# Altium project bldc_motor_driver.PrjPcb
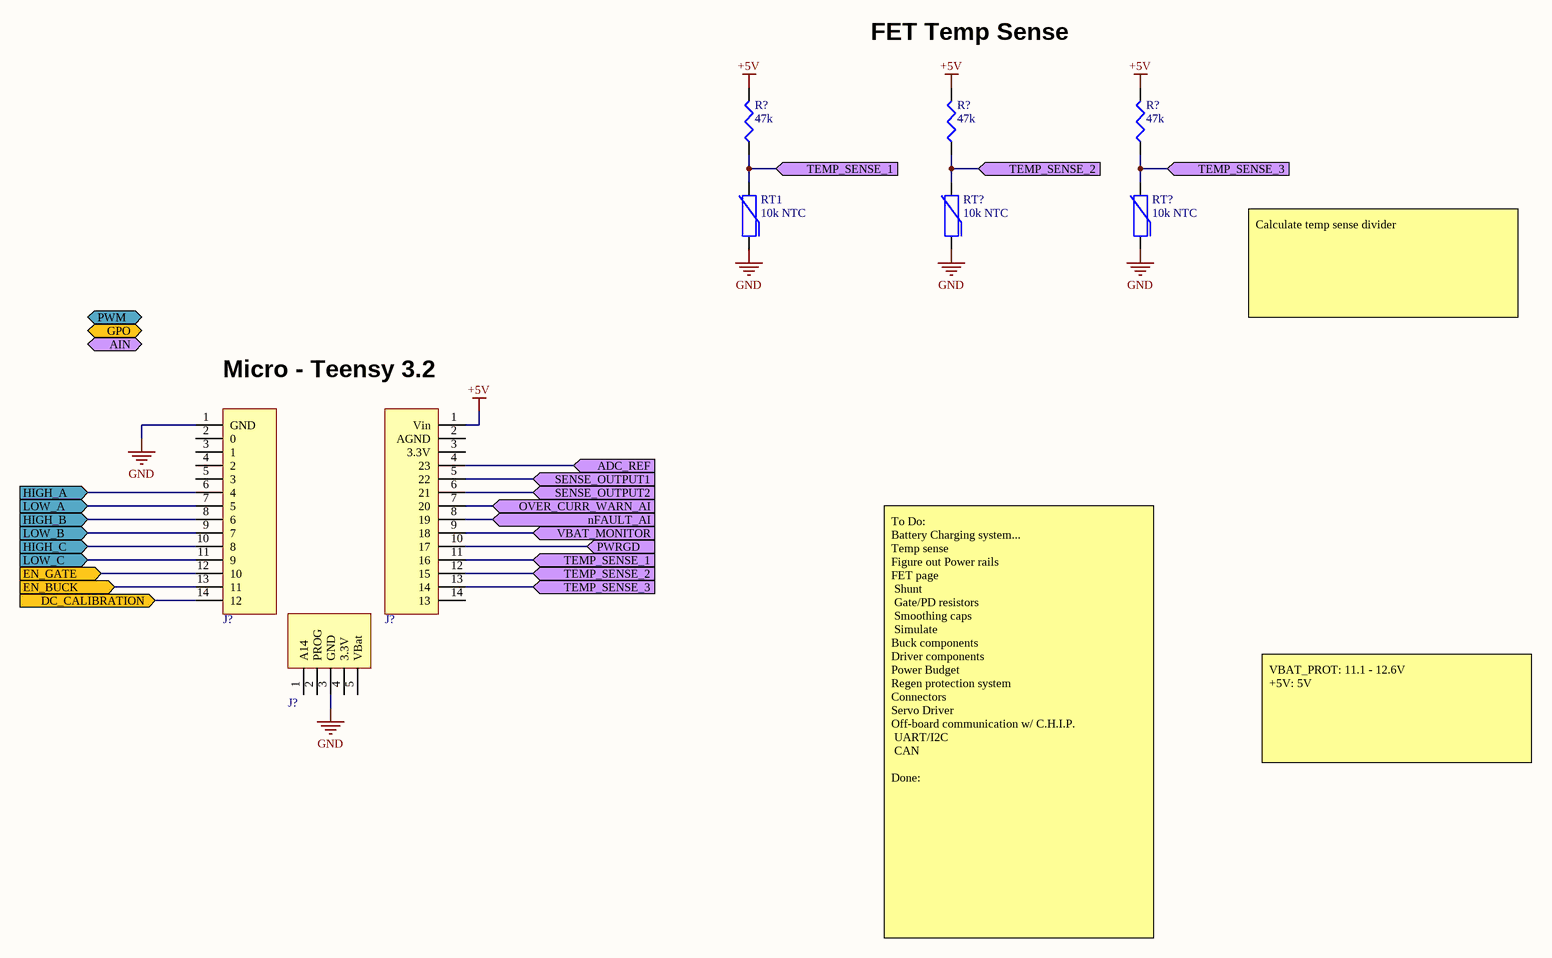
[diagram p0: [01] Micro.SchDoc]
4 sheets, 82 parts. Net scope: flat (ports and power ports of the same name join across sheets).
Sheets:
  [01] Micro.SchDoc
  [02] Power.SchDoc
  [03] Motor Driver.SchDoc
  [04] Half-Bridges.SchDoc

## Sheet [01] Micro.SchDoc
size B; Organization: Altium Limited; Address1: L3, 12a Rodborough Rd; Address2: Frenchs Forest; Address3: NSW; Address4: Australia 2086

### Parts
(Parts that share a designator on the sheet are numbered #1, #2 ... from top to bottom, then left to right.)
J?#1  HEADER TEENSY A  [14 POS HEADER]  (value not drawn)
J?#2  HEADER TEENSY C  [14 POS HEADER]  (value not drawn)
J?#3  HEADER TEENSY B  [5 POS HEADER]  (value not drawn)
R?#1  47k  [0603_CAP]
R?#2  47k  [0603_CAP]
R?#3  47k  [0603_CAP]
RT1  10k NTC  [0603_CAP]
RT?#1  10k NTC  [0603_CAP]
RT?#2  10k NTC  [0603_CAP]

### Ports
ADC_REF (in), AIN (bidir), DC_CALIBRATION (in), EN_BUCK (in), EN_GATE (in), GPO (bidir), HIGH_A (in), HIGH_B (in), HIGH_C (in), LOW_A (in), LOW_B (in), LOW_C (in), nFAULT_AI (in), OVER_CURR_WARN_AI (in), PWM (bidir), PWRGD (in), SENSE_OUTPUT1 (in), SENSE_OUTPUT2 (in), TEMP_SENSE_1 (in), TEMP_SENSE_2 (in), TEMP_SENSE_3 (in), VBAT_MONITOR (in)

### Nets
+5V: J?#2.1(Vin) R?#1.2 R?#2.2 R?#3.2
GND: J?#1.1(GND) J?#3.3(GND) RT1.1 RT?#1.1 RT?#2.1  [project net MOTOR_SHUNT_LS_A]
NetC?#8_2: J?#2.9(18) ; port VBAT_MONITOR
NetC?#13_2: J?#2.7(20) ; port OVER_CURR_WARN_AI
NetC?#18_2: J?#2.8(19) ; port nFAULT_AI
NetJ?#1_6: J?#1.6(4) ; port HIGH_A
NetJ?#1_7: J?#1.7(5) ; port LOW_A
NetJ?#1_8: J?#1.8(6) ; port HIGH_B
NetJ?#1_9: J?#1.9(7) ; port LOW_B
NetJ?#1_10: J?#1.10(8) ; port HIGH_C
NetJ?#1_11: J?#1.11(9) ; port LOW_C
NetJ?#1_12: J?#1.12(10) ; port EN_GATE
NetJ?#1_13: J?#1.13(11) ; port EN_BUCK
NetJ?#1_14: J?#1.14(12) ; port DC_CALIBRATION
NetJ?#2_4: J?#2.4(23) ; port ADC_REF
NetJ?#2_5: J?#2.5(22) ; port SENSE_OUTPUT1
NetJ?#2_6: J?#2.6(21) ; port SENSE_OUTPUT2
NetJ?#2_10: J?#2.10(17) ; port PWRGD
NetJ?#2_11: J?#2.11(16) R?#1.1 RT1.2 ; port TEMP_SENSE_1
NetJ?#2_12: J?#2.12(15) R?#2.1 RT?#1.2 ; port TEMP_SENSE_2
NetJ?#2_13: J?#2.13(14) R?#3.1 RT?#2.2 ; port TEMP_SENSE_3

Not connected (* = marked no-connect by the designer): J?#1 2(0) 3(1) 4(2) 5(3); J?#2 2(AGND) 3(3.3V) 14(13); J?#3 1(A14) 2(PROG) 4(3.3V) 5(VBat)

### Notes on the sheet
- FET Temp Sense
- Calculate temp sense divider
- (near J?#1) Micro - Teensy 3.2
- VBAT_PROT: 11.1 - 12.6V
  +5V: 5V
- To Do:
  Battery Charging system...
  Temp sense
  Figure out Power rails
  FET page
  Shunt
  Gate/PD resistors
  Smoothing caps
  Simulate
  Buck components
  Driver components
  Power Budget
  Regen protection system
  Connectors
  Servo Driver
  Off-board communication w/ C.H.I.P.
  UART/I2C
  CAN
  Done:
- Title
- Size:
- Date:
- B
- Number:
- Time:
- Revision:
- Sheet
- of
- File:

### Library data of the parts
J?#1 = HEADER TEENSY A: SOCKET 7 MM SOLDER TAIL SINGLE; Manufacturer 1: Preci-Dip; Manufacturer Part Number 1: 801-87-014-10-001101; Category 1: Connectors, Interconnects; Number of Positions: 14; Number of Positions Loaded: All; Pitch: 0.100" (2.54mm); Supplier 1: Digi-Key; RoHS: RoHS Compliant; Description 1: SOCKET 7 MM SOLDER TAIL SINGLE; Stock 1: 1111; Pricing 1: 1=1.21, 10=1.065, 100=0.9185, 500=0.75148, 1000=0.66798, 5000=0.58449, 10000=0.55526 (USD); Packaging: Bulk; Part Status: Active; Connector Type: Socket; Contact Type: Female Socket; Number of Rows: 1; Row Spacing: -; Mounting Type: Through Hole; Termination: Solder; Fastening Type: -; Features: -; Contact Finish: Gold; Contact Finish Thickness: Flash; Color: Black; ComponentLink1URL: http://www.precidip.com/AppHost/9696,1/Scripts/Modules/Catalog/Default.aspx?c=7&i=310&p=107&pdf=1&dsku=801-PP-NNN-10-001101; ComponentLink1Description: http://www.precidip.com/AppHost/9696,1/Scripts/Modules/Catalog/Default.aspx?c=7&i=310&p=107&pdf=1&dsku=801-PP-NNN-10-001101; Supplier Part Number 1: 1212-1201-ND
J?#2 = HEADER TEENSY C: SOCKET 7 MM SOLDER TAIL SINGLE; Manufacturer 1: Preci-Dip; Manufacturer Part Number 1: 801-87-014-10-001101; Category 1: Connectors, Interconnects; Number of Positions: 14; Number of Positions Loaded: All; Pitch: 0.100" (2.54mm); Supplier 1: Digi-Key; RoHS: RoHS Compliant; Description 1: SOCKET 7 MM SOLDER TAIL SINGLE; Stock 1: 1111; Pricing 1: 1=1.21, 10=1.065, 100=0.9185, 500=0.75148, 1000=0.66798, 5000=0.58449, 10000=0.55526 (USD); Packaging: Bulk; Part Status: Active; Connector Type: Socket; Contact Type: Female Socket; Number of Rows: 1; Row Spacing: -; Mounting Type: Through Hole; Termination: Solder; Fastening Type: -; Features: -; Contact Finish: Gold; Contact Finish Thickness: Flash; Color: Black; ComponentLink1URL: http://www.precidip.com/AppHost/9696,1/Scripts/Modules/Catalog/Default.aspx?c=7&i=310&p=107&pdf=1&dsku=801-PP-NNN-10-001101; ComponentLink1Description: http://www.precidip.com/AppHost/9696,1/Scripts/Modules/Catalog/Default.aspx?c=7&i=310&p=107&pdf=1&dsku=801-PP-NNN-10-001101; Supplier Part Number 1: 1212-1201-ND
J?#3 = HEADER TEENSY B: SOCKET 7 MM SOLDER TAIL SINGLE; Manufacturer 1: Preci-Dip; Manufacturer Part Number 1: 801-87-005-10-001101; Category 1: Connectors, Interconnects; Number of Positions: 5; Number of Positions Loaded: All; Pitch: 0.100" (2.54mm); Supplier 1: Digi-Key; RoHS: RoHS Compliant; Description 1: SOCKET 7 MM SOLDER TAIL SINGLE; Stock 1: 1229; Pricing 1: 1=0.49, 10=0.459, 100=0.3521, 500=0.3062, 1000=0.25262, 5000=0.222, 10000=0.20669 (USD); Packaging: Bulk; Part Status: Active; Connector Type: Socket; Contact Type: Female Socket; Number of Rows: 1; Row Spacing: -; Mounting Type: Through Hole; Termination: Solder; Fastening Type: -; Features: -; Contact Finish: Gold; Contact Finish Thickness: Flash; Color: Black; ComponentLink1URL: http://www.precidip.com/AppHost/9696,1/Scripts/Modules/Catalog/Default.aspx?c=7&i=310&p=107&pdf=1&dsku=801-PP-NNN-10-001101; ComponentLink1Description: http://www.precidip.com/AppHost/9696,1/Scripts/Modules/Catalog/Default.aspx?c=7&i=310&p=107&pdf=1&dsku=801-PP-NNN-10-001101; Supplier Part Number 1: 1212-1183-ND
R?#1-R?#3 = RC0603FR-073K3L: RES SMD 3.3K OHM 1% 1/10W 0603; Manufacturer 1: Yageo; Category 1: Resistors; Power (Watts): 0.1W, 1/10W; Temperature Coefficient: ±100ppm/°C; Supplier 1: Digi-Key; Manufacturer Part Number 1: RC0603FR-073K3L; RoHS: RoHS Compliant; Description 1: RES SMD 3.3K OHM 1% 1/10W 0603; Stock 1: 668905; Pricing 1: 1=0.1, 10=0.014, 25=0.01, 100=0.0057, 250=0.00436, 500=0.00348, 1000=0.00257, 2500=0.00223 (USD); Packaging: Cut Tape (CT); Resistance (Ohms): 3.3k; Tolerance: ±1%; Composition: Thick Film; Features: Moisture Resistant; Operating Temperature: -55°C ~ 155°C; Package / Case: 0603 (1608 Metric); Supplier Device Package: 0603; Size / Dimension: 0.063" L x 0.031" W (1.60mm x 0.80mm); Height: 0.022" (0.55mm); Number of Terminations: 2; ComponentLink1URL: http://www.yageo.com/documents/recent/PYu-RC_Group_51_RoHS_L_04.pdf; ComponentLink1Description: http://www.yageo.com/documents/recent/PYu-RC_Group_51_RoHS_L_04.pdf; Supplier Part Number 1: 311-3.30KHRCT-ND
RT1 RT?#1 RT?#2 = NCP18XH103J03RB: THERMISTOR 10K OHM NTC 0603 SMD; Manufacturer 1: Murata Electronics North America; Category 1: Sensors, Transducers; Resistance Tolerance: ±5%; B Value Tolerance: ±1%; B25/50: 3380K; B25/85: 3434K; B25/100: 3455K; Power - Max: 100mW; Supplier 1: Digi-Key; Manufacturer Part Number 1: NCP18XH103J03RB; RoHS: RoHS Compliant; Description 1: THERMISTOR 10K OHM NTC 0603 SMD; Stock 1: 94115; Pricing 1: 1=0.2, 10=0.169, 25=0.1556, 50=0.1244, 100=0.1067, 250=0.09776, 500=0.09332, 1000=0.07999 (USD); Packaging: Cut Tape (CT); Resistance in Ohms @ 25°C: 10k; B0/50: -; B25/75: -; Operating Temperature: -40°C ~ 125°C; Length - Lead Wire: -; Mounting Type: Surface Mount; Package / Case: 0603 (1608 Metric); ComponentLink1URL: http://www.murata.com/~/media/webrenewal/support/library/catalog/products/thermistor/ntc/r44e.ashx; ComponentLink1Description: http://www.murata.com/~/media/webrenewal/support/library/catalog/products/thermistor/ntc/r44e.ashx; Supplier Part Number 1: 490-2436-1-ND

## Sheet [02] Power.SchDoc
size B; Organization: Altium Limited; Address1: L3, 12a Rodborough Rd; Address2: Frenchs Forest; Address3: NSW; Address4: Australia 2086
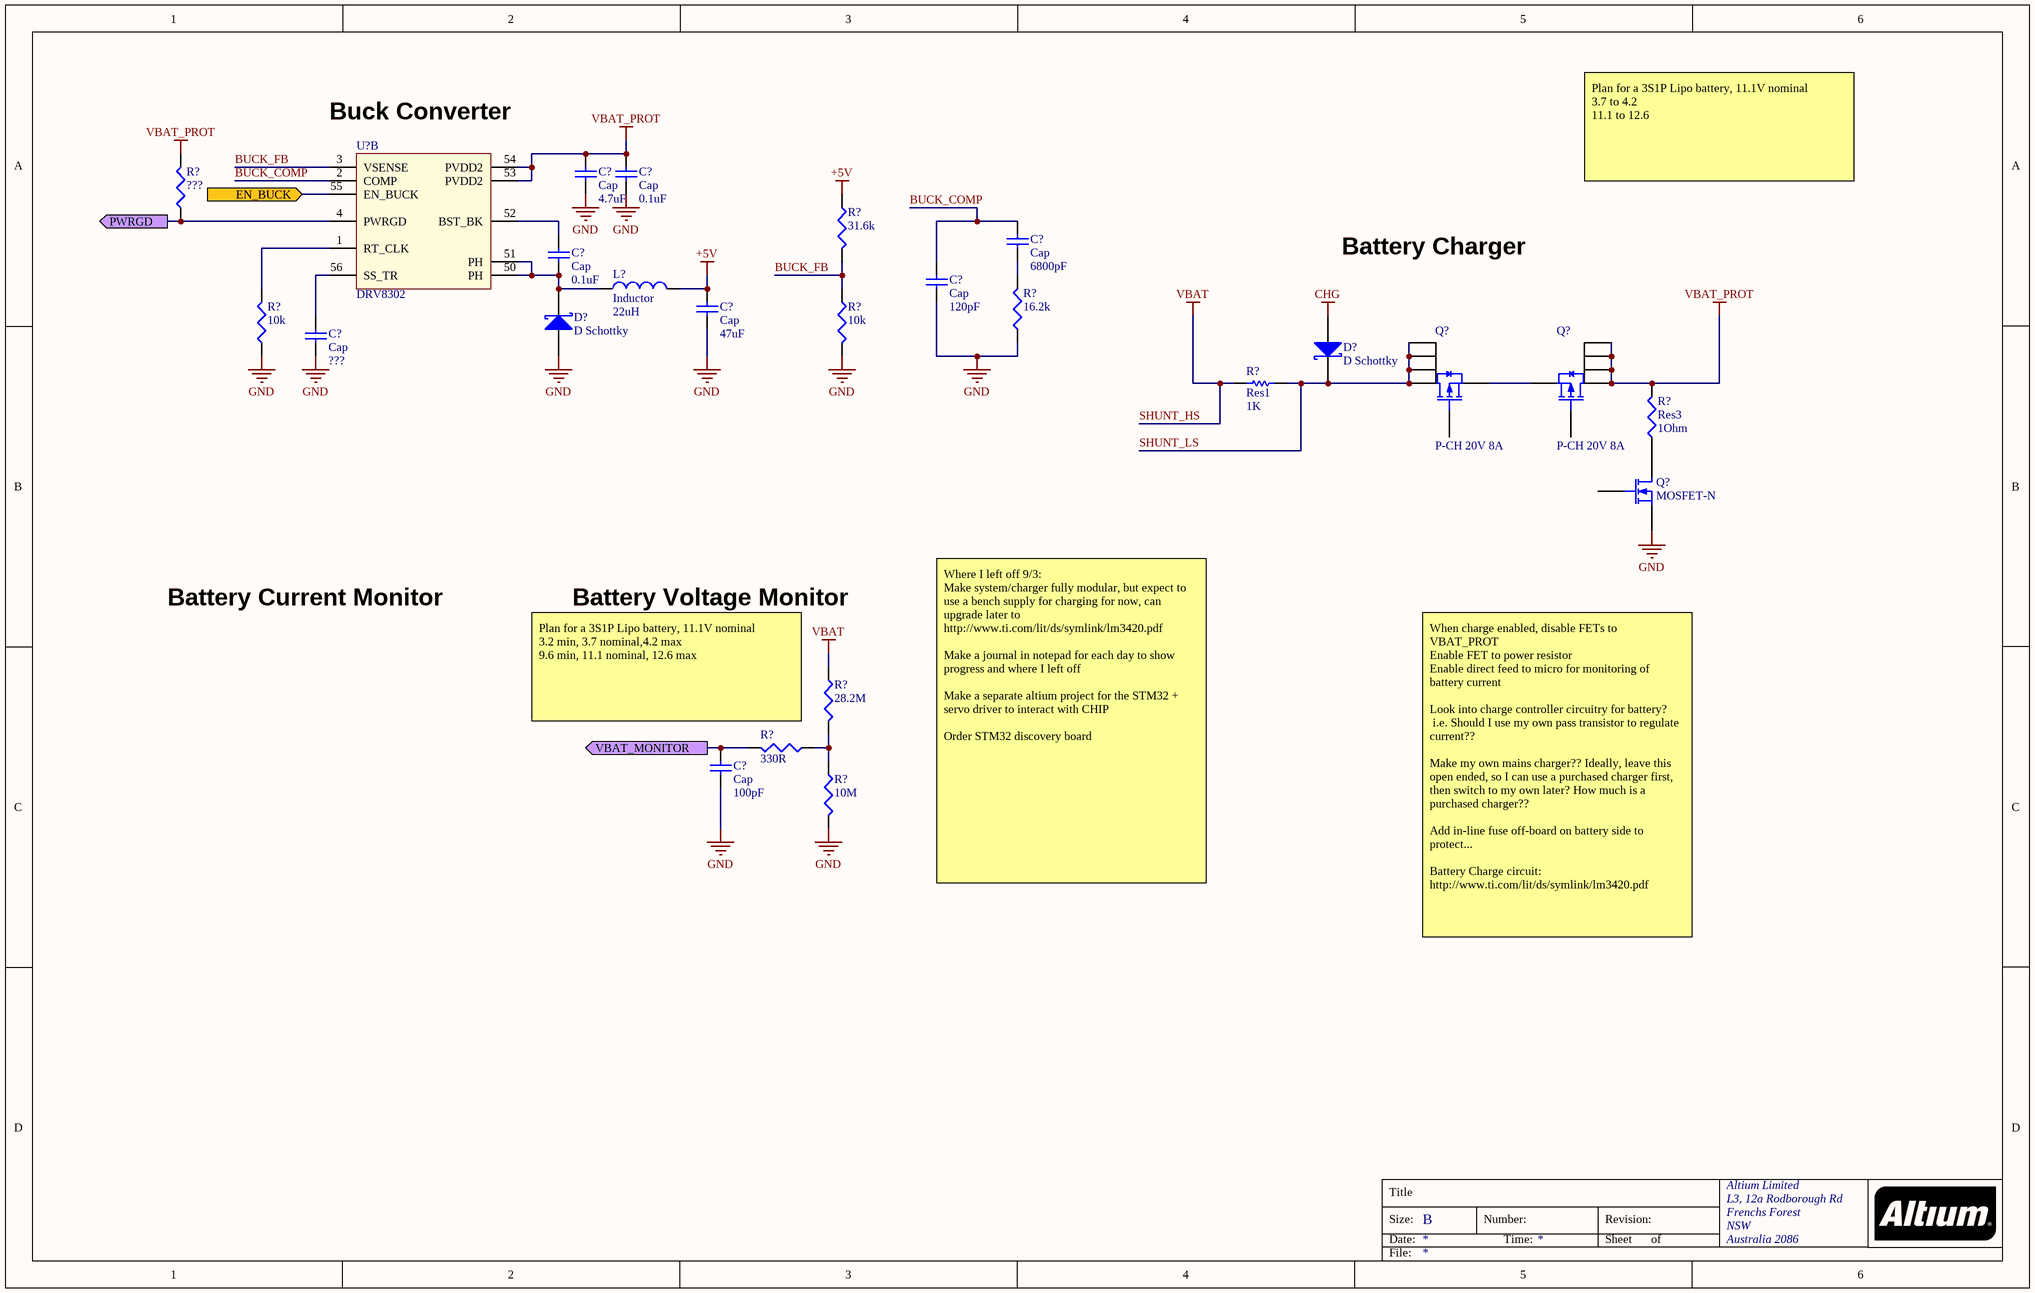
[diagram p1: [02] Power.SchDoc]

### Parts
(Parts that share a designator on the sheet are numbered #1, #2 ... from top to bottom, then left to right.)
C?#1  Cap  value 4.7uF  [RAD-0.3]
C?#2  Cap  value 0.1uF  [RAD-0.3]
C?#3  Cap  value 6800pF  [RAD-0.3]
C?#4  Cap  value 0.1uF  [RAD-0.3]
C?#5  Cap  value 120pF  [RAD-0.3]
C?#6  Cap  value 47uF  [RAD-0.3]
C?#7  Cap  value ???  [RAD-0.3]
C?#8  Cap  value 100pF  [RAD-0.3]
D?#1  D Schottky  [SMB]
D?#2  D Schottky  [SMB]
L?  Inductor  value 22uH  [AXIAL-0.8]
Q?#1  P-CH 20V 8A  [TSOP-6]
Q?#2  P-CH 20V 8A  [TSOP-6]
Q?#3  MOSFET-N  [E3]
R?#4  ???  [0603_CAP]
R?#5  31.6k  [0603_CAP]
R?#6  16.2k  [0603_CAP]
R?#7  10k  [0603_CAP]
R?#8  10k  [0603_CAP]
R?#9  Res1  value 1K  [AXIAL-0.3]
R?#10  Res3  value 1Ohm  [J1-0603]
R?#11  28.2M  [0603_CAP]
R?#12  330R  [0603_CAP]
R?#13  10M  [0603_CAP]
U?#1  DRV8302  (part B of 2)

### Ports
EN_BUCK (in), PWRGD (out), VBAT_MONITOR (out)

### Nets
+5V: C?#6.2 L?.2 R?#5.2
CHG: D?#2.1(A)
GND: C?#1.1 C?#2.1 C?#5.1 C?#6.1 C?#7.1 C?#8.1 D?#1.1(A) Q?#3.3(S) R?#6.1 R?#7.1 R?#8.1 R?#13.1  [project net MOTOR_SHUNT_LS_A]
SHUNT_HS: R?#9.1 R?#11.2  [also labelled VBAT]
VBAT_PROT: C?#1.2 C?#2.2 Q?#2.1(D) Q?#2.2(D) Q?#2.5(D) Q?#2.6(D) R?#4.2 R?#10.2 U?#1.53(PVDD2) U?#1.54(PVDD2)
BUCK_COMP: C?#3.2 C?#5.2 U?#1.2(COMP)
BUCK_FB: R?#5.1 R?#8.2 U?#1.3(VSENSE)
SHUNT_LS: D?#2.2(K) Q?#1.1(D) Q?#1.2(D) Q?#1.5(D) Q?#1.6(D) R?#9.2
NetC?#3_1: C?#3.1 R?#6.2
NetC?#4_1: C?#4.1 D?#1.2(K) L?.1 U?#1.50(PH) U?#1.51(PH)
NetC?#4_2: C?#4.2 U?#1.52(BST_BK)
NetC?#7_2: C?#7.2 U?#1.56(SS_TR)
NetC?#8_2: C?#8.2 R?#12.1 ; port VBAT_MONITOR
NetJ?#1_13: U?#1.55(EN_BUCK) ; port EN_BUCK
NetJ?#2_10: R?#4.1 U?#1.4(PWRGD) ; port PWRGD
NetQ?#1_4: Q?#1.4(S) Q?#2.4(S)
NetQ?#3_1: Q?#3.1(D) R?#10.1
NetR?#7_2: R?#7.2 U?#1.1(RT_CLK)
NetR?#11_1: R?#11.1 R?#12.2 R?#13.2

Not connected (* = marked no-connect by the designer): Q?#1 3(G); Q?#2 3(G); Q?#3 2(G)

### Notes on the sheet
- (near U?#1) Buck Converter
- Plan for a 3S1P Lipo battery, 11.1V nominal
  3.7 to 4.2
  11.1 to 12.6
- Battery Charger
- Battery Current Monitor
- Battery Voltage Monitor
- (near R?#11) Plan for a 3S1P Lipo battery, 11.1V nominal
  3.2 min, 3.7 nominal,4.2 max
  9.6 min, 11.1 nominal, 12.6 max
- Where I left off 9/3:
  Make system/charger fully modular, but expect to use a bench supply for charging for now, can upgrade later to
  http://www.ti.com/lit/ds/symlink/lm3420.pdf
  Make a journal in notepad for each day to show progress and where I left off
  Make a separate altium project for the STM32 + servo driver to interact with CHIP
  Order STM32 discovery board
- When charge enabled, disable FETs to VBAT_PROT
  Enable FET to power resistor
  Enable direct feed to micro for monitoring of battery current
  Look into charge controller circuitry for battery?
  i.e. Should I use my own pass transistor to regulate current??
  Make my own mains charger?? Ideally, leave this open ended, so I can use a purchased charger first, then switch to my own later? How much is a purchased charger??
  Add in-line fuse off-board on battery side to protect...
  Battery Charge circuit:
  http://www.ti.com/lit/ds/symlink/lm3420.pdf
- Title
- Size:
- Date:
- B
- Number:
- Time:
- Revision:
- Sheet
- of
- File:

### Library data of the parts
C?#1-C?#8 = Cap: Capacitor; Published: 8-Jun-2000; LatestRevisionDate: 17-Jul-2002; LatestRevisionNote: Re-released for DXP Platform.; PackageReference: RAD-0.3; Publisher: Altium Limited; PackageDescription: Radial Cap, Thru-Hole; 2 Leads; 0.3 in Pin Spacing
D?#1 D?#2 = D Schottky: Schottky Diode; Published: 8-Jun-2000; LatestRevisionDate: 17-Jul-2002; LatestRevisionNote: Re-released for DXP Platform.; PackageReference: SMB; Publisher: Altium Limited; PackageDescription: DO-214-AA/SMB; 2 C-Bend Leads; Body 5.3 x 3.6 mm, inc. leads (LxW); Code_JEDEC: DO-214-AA
L? = Inductor: Code_IEC: 1005; Published: 8-Jun-2000; LatestRevisionDate: 29-May-2009; LatestRevisionNote: IPC-7351 Footprint Added.; PackageReference: 0402-A; Publisher: Altium Limited; PackageDescription: Chip Inductor; Code_JEITA: 0402
Q?#1 Q?#2 = SI3407DV-T1-GE3: MOSFET P-CH 20V 8A 6-TSOP; Manufacturer 1: Vishay Siliconix; Category 1: Discrete Semiconductor Products; FET Type: MOSFET P-Channel, Metal Oxide; FET Feature: Standard; Current - Continuous Drain (Id) @ 25°C: 8A (Tc); Rds On (Max) @ Id, Vgs: 24 mOhm @ 7.5A, 4.5V; Vgs(th) (Max) @ Id: 1.5V @ 250µA; Gate Charge (Qg) @ Vgs: 63nC @ 10V; Input Capacitance (Ciss) @ Vds: 1670pF @ 10V; Power - Max: 4.2W; Supplier 1: Digi-Key; Manufacturer Part Number 1: SI3407DV-T1-GE3; RoHS: RoHS Compliant; Description 1: MOSFET P-CH 20V 8A 6-TSOP; Stock 1: 6059; Pricing 1: 1=0.5, 10=0.425, 25=0.3964, 100=0.3172, 250=0.2946, 500=0.24926, 1000=0.19261 (USD); Packaging: Cut Tape (CT); Part Status: Active; Drain to Source Voltage (Vdss): 20V; Operating Temperature: -55°C ~ 150°C (TJ); Mounting Type: Surface Mount; Package / Case: SOT-23-6 Thin, TSOT-23-6; Supplier Device Package: 6-TSOP; ComponentLink1URL: http://www.vishay.com/docs/69987/si3407dv.pdf; ComponentLink1Description: http://www.vishay.com/docs/69987/si3407dv.pdf; Supplier Part Number 1: SI3407DV-T1-GE3CT-ND
Q?#3 = MOSFET-N: N-Channel MOSFET; Published: 8-Jun-2000; LatestRevisionDate: 17-Jul-2002; LatestRevisionNote: Re-released for DXP Platform.; PackageVersion: 1995/1996; PackageReference: E3; Publisher: Altium Limited; PackageDescription: TO, Flat Index; 3 In-Line, Axial Leads; Body Dia. 4.6mm; Lead Dia. 0.5 mm (max)
R?#4-R?#8 R?#11-R?#13 = RC0603FR-073K3L: as R?#1 on sheet [01] Micro; Supplier 1: Digi-Key; Manufacturer Part Number 1: RC0603FR-073K3L; RoHS: RoHS Compliant; Description 1: RES SMD 3.3K OHM 1% 1/10W 0603; Stock 1: 668905; Pricing 1: 1=0.1, 10=0.014, 25=0.01, 100=0.0057, 250=0.00436, 500=0.00348, 1000=0.00257, 2500=0.00223 (USD); Packaging: Cut Tape (CT); Resistance (Ohms): 3.3k; Tolerance: ±1%; Composition: Thick Film; Features: Moisture Resistant; Operating Temperature: -55°C ~ 155°C; Package / Case: 0603 (1608 Metric); Supplier Device Package: 0603; Size / Dimension: 0.063" L x 0.031" W (1.60mm x 0.80mm); Height: 0.022" (0.55mm); Number of Terminations: 2; ComponentLink1URL: http://www.yageo.com/documents/recent/PYu-RC_Group_51_RoHS_L_04.pdf; ComponentLink1Description: http://www.yageo.com/documents/recent/PYu-RC_Group_51_RoHS_L_04.pdf; Supplier Part Number 1: 311-3.30KHRCT-ND
R?#9 = Res1: Resistor; Published: 8-Jun-2000; LatestRevisionDate: 17-Jul-2002; LatestRevisionNote: Re-released for DXP Platform.; PackageReference: AXIAL-0.3; Publisher: Altium Limited; PackageDescription: Axial Device, Thru-Hole; 2 Leads; 0.3 in Pin Spacing
R?#10 = Res3: Resistor; Published: 8-Jun-2000; LatestRevisionDate: 29-May-2009; LatestRevisionNote: IPC-7351 Footprint Added.; PackageReference: J1-0603; Publisher: Altium Limited; PackageDescription: Chip Resistor
U?#1 = DRV8302DCAR: IC MOTOR CONTROLLER PAR 56HTSSOP; Manufacturer 1: Texas Instruments; Category 1: Integrated Circuits (ICs); Motor Type - AC, DC: Brushless DC (BLDC); Function: Controller - Commutation, Direction Management; Output Configuration: Pre-Driver - Half Bridge (3); Interface: Parallel; Voltage - Supply: 8 V ~ 60 V; Supplier 1: Digi-Key; Manufacturer Part Number 1: DRV8302DCAR; RoHS: RoHS Compliant; Description 1: IC MOTOR CONTROLLER PAR 56HTSSOP; Stock 1: 3089; Pricing 1: 1=6.14, 10=5.516, 100=4.5191, 500=3.84706, 1000=3.2445 (USD); Packaging: Cut Tape (CT); Part Status: Active; Motor Type - Stepper: -; Technology: Power MOSFET; Step Resolution: -; Applications: General Purpose; Current - Output: -; Voltage - Load: -; Operating Temperature: -40°C ~ 125°C (TA); Mounting Type: Surface Mount; Package / Case: 56-TFSOP (0.240", 6.10mm Width) Exposed Pad; Supplier Device Package: 56-HTSSOP; ComponentLink1URL: http://www.ti.com/lit/ds/symlink/drv8302.pdf; ComponentLink1Description: http://www.ti.com/lit/ds/symlink/drv8302.pdf; Supplier Part Number 1: 296-29544-1-ND

## Sheet [03] Motor Driver.SchDoc
size B; Organization: Altium Limited; Address1: L3, 12a Rodborough Rd; Address2: Frenchs Forest; Address3: NSW; Address4: Australia 2086
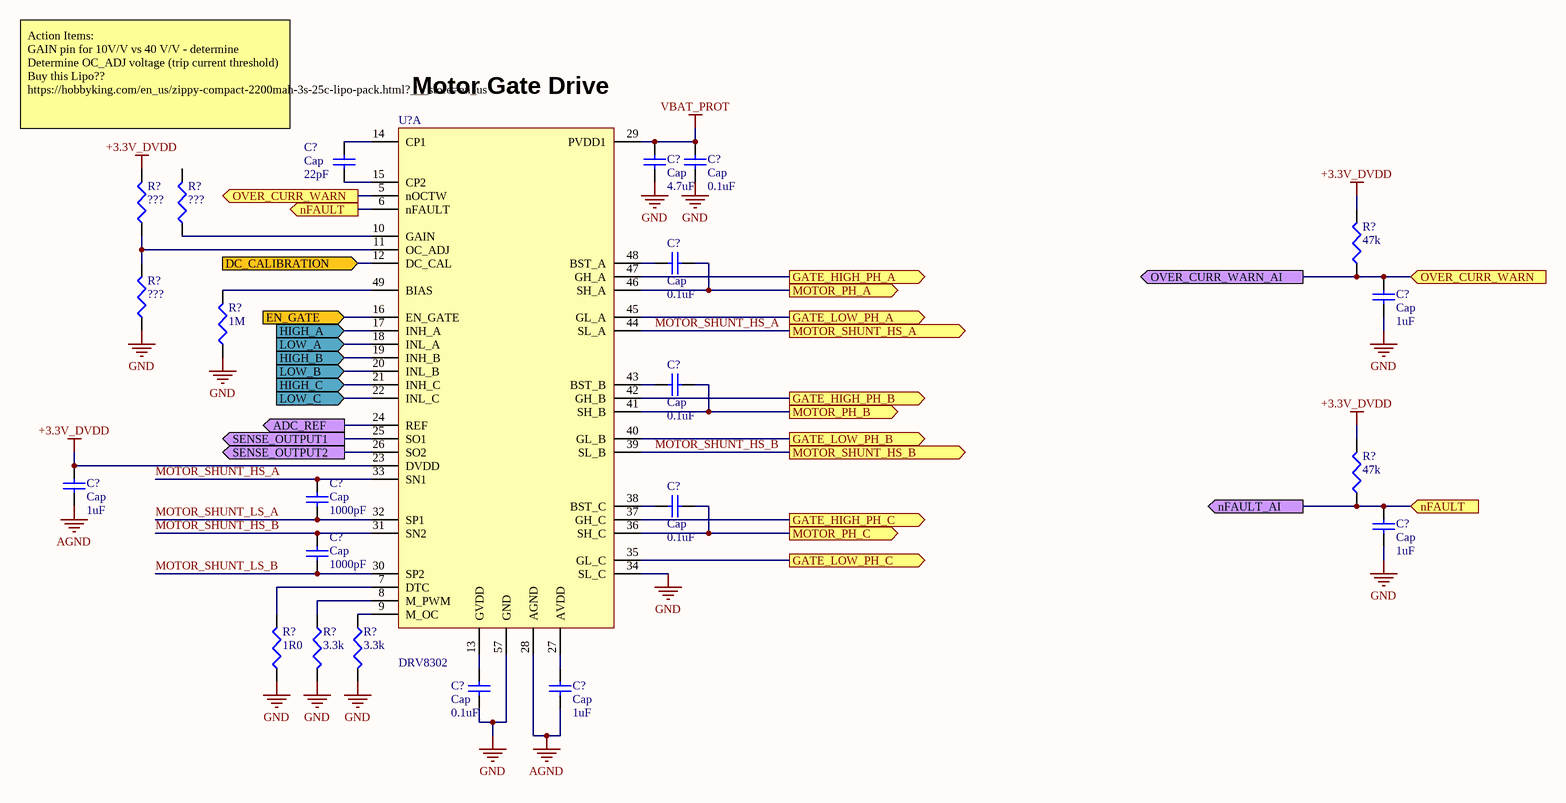
[diagram p2: [03] Motor Driver.SchDoc]

### Parts
(Parts that share a designator on the sheet are numbered #1, #2 ... from top to bottom, then left to right.)
C?#9  Cap  value 22pF  [RAD-0.3]
C?#10  Cap  value 4.7uF  [RAD-0.3]
C?#11  Cap  value 0.1uF  [RAD-0.3]
C?#12  Cap  value 0.1uF  [RAD-0.3]
C?#13  Cap  value 1uF  [RAD-0.3]
C?#14  Cap  value 0.1uF  [RAD-0.3]
C?#15  Cap  value 1uF  [RAD-0.3]
C?#16  Cap  value 0.1uF  [RAD-0.3]
C?#17  Cap  value 1000pF  [RAD-0.3]
C?#18  Cap  value 1uF  [RAD-0.3]
C?#19  Cap  value 1000pF  [RAD-0.3]
C?#20  Cap  value 0.1uF  [RAD-0.3]
C?#21  Cap  value 1uF  [RAD-0.3]
R?#14  ???  [0603_CAP]
R?#15  ???  [0603_CAP]
R?#16  47k  [0603_CAP]
R?#17  ???  [0603_CAP]
R?#18  1M  [0603_CAP]
R?#19  47k  [0603_CAP]
R?#20  3.3k  [0603_CAP]
R?#21  3.3k  [0603_CAP]
R?#22  1R0  [0603_CAP]
U?#2  DRV8302  (part A of 2)

### Ports
ADC_REF (out), DC_CALIBRATION (in), EN_GATE (in), GATE_HIGH_PH_A (out), GATE_HIGH_PH_B (out), GATE_HIGH_PH_C (out), GATE_LOW_PH_A (out), GATE_LOW_PH_B (out), GATE_LOW_PH_C (out), HIGH_A (in), HIGH_B (in), HIGH_C (in), LOW_A (in), LOW_B (in), LOW_C (in), MOTOR_PH_A (out), MOTOR_PH_B (out), MOTOR_PH_C (out), MOTOR_SHUNT_HS_A (out), MOTOR_SHUNT_HS_B (out), nFAULT (in), nFAULT (out), nFAULT_AI (out), OVER_CURR_WARN (in), OVER_CURR_WARN (out), OVER_CURR_WARN_AI (out), SENSE_OUTPUT1 (out), SENSE_OUTPUT2 (out)

### Nets
+3.3V_DVDD: C?#15.2 R?#14.2 R?#16.2 R?#19.2 U?#2.23(DVDD)
AGND: C?#15.1 C?#21.1 U?#2.28(AGND)
GND: C?#10.1 C?#11.1 C?#13.1 C?#18.1 C?#20.1 R?#17.1 R?#18.1 R?#20.2 R?#21.2 R?#22.1 U?#2.34(SL_C) U?#2.57(GND)  [project net MOTOR_SHUNT_LS_A]
VBAT_PROT: C?#10.2 C?#11.2 U?#2.29(PVDD1)
MOTOR_SHUNT_HS_A: C?#17.2 U?#2.33(SN1) U?#2.44(SL_A) ; port MOTOR_SHUNT_HS_A
MOTOR_SHUNT_HS_B: C?#19.2 U?#2.31(SN2) U?#2.39(SL_B) ; port MOTOR_SHUNT_HS_B
MOTOR_SHUNT_LS_A: C?#17.1 U?#2.32(SP1)
MOTOR_SHUNT_LS_B: C?#19.1 U?#2.30(SP2)
NetC?#9_1: C?#9.1 U?#2.15(CP2)
NetC?#9_2: C?#9.2 U?#2.14(CP1)
NetC?#12_1: C?#12.1 U?#2.48(BST_A)
NetC?#12_2: C?#12.2 U?#2.46(SH_A) ; port MOTOR_PH_A
NetC?#13_2: C?#13.2 R?#16.1 U?#2.5(nOCTW) ; port OVER_CURR_WARN, port OVER_CURR_WARN_AI
NetC?#14_1: C?#14.1 U?#2.43(BST_B)
NetC?#14_2: C?#14.2 U?#2.41(SH_B) ; port MOTOR_PH_B
NetC?#16_1: C?#16.1 U?#2.38(BST_C)
NetC?#16_2: C?#16.2 U?#2.36(SH_C) ; port MOTOR_PH_C
NetC?#18_2: C?#18.2 R?#19.1 U?#2.6(nFAULT) ; port nFAULT, port nFAULT_AI
NetC?#20_2: C?#20.2 U?#2.13(GVDD)
NetC?#21_2: C?#21.2 U?#2.27(AVDD)
NetJ?#1_6: U?#2.17(INH_A) ; port HIGH_A
NetJ?#1_7: U?#2.18(INL_A) ; port LOW_A
NetJ?#1_8: U?#2.19(INH_B) ; port HIGH_B
NetJ?#1_9: U?#2.20(INL_B) ; port LOW_B
NetJ?#1_10: U?#2.21(INH_C) ; port HIGH_C
NetJ?#1_11: U?#2.22(INL_C) ; port LOW_C
NetJ?#1_12: U?#2.16(EN_GATE) ; port EN_GATE
NetJ?#1_14: U?#2.12(DC_CAL) ; port DC_CALIBRATION
NetJ?#2_4: U?#2.24(REF) ; port ADC_REF
NetJ?#2_5: U?#2.25(SO1) ; port SENSE_OUTPUT1
NetJ?#2_6: U?#2.26(SO2) ; port SENSE_OUTPUT2
NetR4#1_2: U?#2.47(GH_A) ; port GATE_HIGH_PH_A
NetR4#3_2: U?#2.42(GH_B) ; port GATE_HIGH_PH_B
NetR4#5_2: U?#2.37(GH_C) ; port GATE_HIGH_PH_C
NetR4#7_2: U?#2.45(GL_A) ; port GATE_LOW_PH_A
NetR4#9_2: U?#2.40(GL_B) ; port GATE_LOW_PH_B
NetR4#11_2: U?#2.35(GL_C) ; port GATE_LOW_PH_C
NetR?#14_1: R?#14.1 R?#17.2 U?#2.11(OC_ADJ)
NetR?#15_1: R?#15.1 U?#2.10(GAIN)
NetR?#18_2: R?#18.2 U?#2.49(BIAS)
NetR?#20_1: R?#20.1 U?#2.8(M_PWM)
NetR?#21_1: R?#21.1 U?#2.9(M_OC)
NetR?#22_2: R?#22.2 U?#2.7(DTC)

Not connected (* = marked no-connect by the designer): R?#15 2

### Notes on the sheet
- Action Items:
  GAIN pin for 10V/V vs 40 V/V - determine
  Determine OC_ADJ voltage (trip current threshold)
  Buy this Lipo?? https://hobbyking.com/en_us/zippy-compact-2200mah-3s-25c-lipo-pack.html?___store=en_us
- (near U?#2) Motor Gate Drive
- Title
- Size:
- Date:
- B
- Number:
- Time:
- Revision:
- Sheet
- of
- File:

### Library data of the parts
C?#9-C?#21 = Cap: Capacitor; Published: 8-Jun-2000; LatestRevisionDate: 17-Jul-2002; LatestRevisionNote: Re-released for DXP Platform.; PackageReference: RAD-0.3; Publisher: Altium Limited; PackageDescription: Radial Cap, Thru-Hole; 2 Leads; 0.3 in Pin Spacing
R?#14-R?#22 = RC0603FR-073K3L: as R?#1 on sheet [01] Micro; Supplier 1: Digi-Key; Manufacturer Part Number 1: RC0603FR-073K3L; RoHS: RoHS Compliant; Description 1: RES SMD 3.3K OHM 1% 1/10W 0603; Stock 1: 668905; Pricing 1: 1=0.1, 10=0.014, 25=0.01, 100=0.0057, 250=0.00436, 500=0.00348, 1000=0.00257, 2500=0.00223 (USD); Packaging: Cut Tape (CT); Resistance (Ohms): 3.3k; Tolerance: ±1%; Composition: Thick Film; Features: Moisture Resistant; Operating Temperature: -55°C ~ 155°C; Package / Case: 0603 (1608 Metric); Supplier Device Package: 0603; Size / Dimension: 0.063" L x 0.031" W (1.60mm x 0.80mm); Height: 0.022" (0.55mm); Number of Terminations: 2; ComponentLink1URL: http://www.yageo.com/documents/recent/PYu-RC_Group_51_RoHS_L_04.pdf; ComponentLink1Description: http://www.yageo.com/documents/recent/PYu-RC_Group_51_RoHS_L_04.pdf; Supplier Part Number 1: 311-3.30KHRCT-ND
U?#2 = DRV8302DCAR: as U?#1 on sheet [02] Power; Supplier 1: Digi-Key; Manufacturer Part Number 1: DRV8302DCAR; RoHS: RoHS Compliant; Description 1: IC MOTOR CONTROLLER PAR 56HTSSOP; Stock 1: 3089; Pricing 1: 1=6.14, 10=5.516, 100=4.5191, 500=3.84706, 1000=3.2445 (USD); Packaging: Cut Tape (CT); Part Status: Active; Motor Type - Stepper: -; Technology: Power MOSFET; Step Resolution: -; Applications: General Purpose; Current - Output: -; Voltage - Load: -; Operating Temperature: -40°C ~ 125°C (TA); Mounting Type: Surface Mount; Package / Case: 56-TFSOP (0.240", 6.10mm Width) Exposed Pad; Supplier Device Package: 56-HTSSOP; ComponentLink1URL: http://www.ti.com/lit/ds/symlink/drv8302.pdf; ComponentLink1Description: http://www.ti.com/lit/ds/symlink/drv8302.pdf; Supplier Part Number 1: 296-29544-1-ND

## Sheet [04] Half-Bridges.SchDoc
size B; Organization: Altium Limited; Address1: L3, 12a Rodborough Rd; Address2: Frenchs Forest; Address3: NSW; Address4: Australia 2086
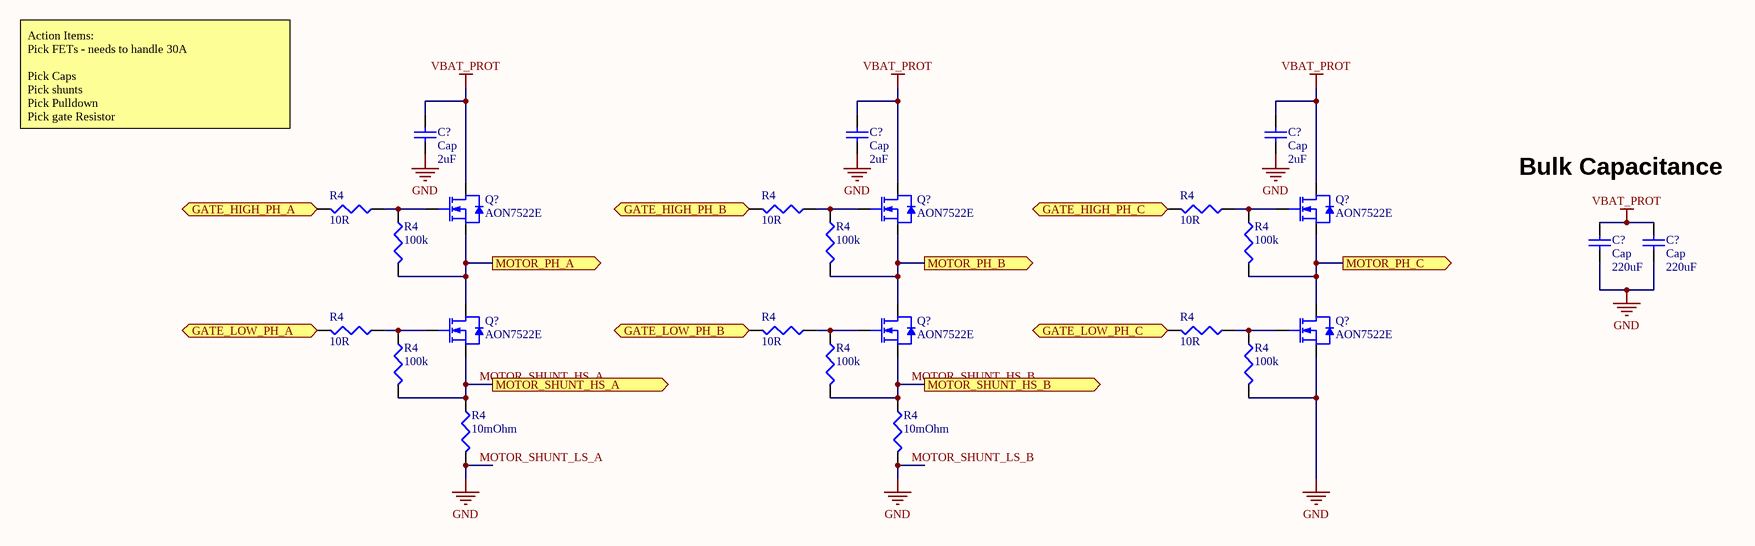
[diagram p3: [04] Half-Bridges.SchDoc]

### Parts
(Parts that share a designator on the sheet are numbered #1, #2 ... from top to bottom, then left to right.)
C?#22  Cap  value 2uF  [RAD-0.3]
C?#23  Cap  value 2uF  [RAD-0.3]
C?#24  Cap  value 2uF  [RAD-0.3]
C?#25  Cap  value 220uF  [RAD-0.3]
C?#26  Cap  value 220uF  [RAD-0.3]
Q?#4  AON7522E
Q?#5  AON7522E
Q?#6  AON7522E
Q?#7  AON7522E
Q?#8  AON7522E
Q?#9  AON7522E
R4#1  10R  [0603_CAP]
R4#2  100k  [0603_CAP]
R4#3  10R  [0603_CAP]
R4#4  100k  [0603_CAP]
R4#5  10R  [0603_CAP]
R4#6  100k  [0603_CAP]
R4#7  10R  [0603_CAP]
R4#8  100k  [0603_CAP]
R4#9  10R  [0603_CAP]
R4#10  100k  [0603_CAP]
R4#11  10R  [0603_CAP]
R4#12  100k  [0603_CAP]
R4#13  10mOhm  [0603_CAP]
R4#14  10mOhm  [0603_CAP]

### Ports
GATE_HIGH_PH_A (in), GATE_HIGH_PH_B (in), GATE_HIGH_PH_C (in), GATE_LOW_PH_A (in), GATE_LOW_PH_B (in), GATE_LOW_PH_C (in), MOTOR_PH_A (out), MOTOR_PH_B (out), MOTOR_PH_C (out), MOTOR_SHUNT_HS_A (out), MOTOR_SHUNT_HS_B (out)

### Nets
MOTOR_SHUNT_LS_A: C?#22.1 C?#23.1 C?#24.1 C?#25.1 C?#26.1 Q?#9.1(S) R4#12.2 R4#13.2 R4#14.2  [also labelled GND, MOTOR_SHUNT_LS_B]
VBAT_PROT: C?#22.2 C?#23.2 C?#24.2 C?#25.2 C?#26.2 Q?#4.8(D) Q?#5.8(D) Q?#6.8(D)
MOTOR_SHUNT_HS_A: Q?#7.1(S) R4#8.2 R4#13.1 ; port MOTOR_SHUNT_HS_A
MOTOR_SHUNT_HS_B: Q?#8.1(S) R4#10.2 R4#14.1 ; port MOTOR_SHUNT_HS_B
NetC?#12_2: Q?#4.1(S) Q?#7.8(D) R4#2.2 ; port MOTOR_PH_A
NetC?#14_2: Q?#5.1(S) Q?#8.8(D) R4#4.2 ; port MOTOR_PH_B
NetC?#16_2: Q?#6.1(S) Q?#9.8(D) R4#6.2 ; port MOTOR_PH_C
NetQ?#4_4: Q?#4.4(G) R4#1.1 R4#2.1
NetQ?#5_4: Q?#5.4(G) R4#3.1 R4#4.1
NetQ?#6_4: Q?#6.4(G) R4#5.1 R4#6.1
NetQ?#7_4: Q?#7.4(G) R4#7.1 R4#8.1
NetQ?#8_4: Q?#8.4(G) R4#9.1 R4#10.1
NetQ?#9_4: Q?#9.4(G) R4#11.1 R4#12.1
NetR4#1_2: R4#1.2 ; port GATE_HIGH_PH_A
NetR4#3_2: R4#3.2 ; port GATE_HIGH_PH_B
NetR4#5_2: R4#5.2 ; port GATE_HIGH_PH_C
NetR4#7_2: R4#7.2 ; port GATE_LOW_PH_A
NetR4#9_2: R4#9.2 ; port GATE_LOW_PH_B
NetR4#11_2: R4#11.2 ; port GATE_LOW_PH_C

### Notes on the sheet
- Action Items:
  Pick FETs - needs to handle 30A
  Pick Caps
  Pick shunts
  Pick Pulldown
  Pick gate Resistor
- Bulk Capacitance
- Title
- Size:
- Date:
- B
- Number:
- Time:
- Revision:
- Sheet
- of
- File:

### Library data of the parts
C?#22-C?#26 = Cap: Capacitor; Published: 8-Jun-2000; LatestRevisionDate: 17-Jul-2002; LatestRevisionNote: Re-released for DXP Platform.; PackageReference: RAD-0.3; Publisher: Altium Limited; PackageDescription: Radial Cap, Thru-Hole; 2 Leads; 0.3 in Pin Spacing
Q?#4-Q?#9 = AON7522E: MOSFET N-CH 30V 21A 8DFN; Manufacturer: Alpha & Omega Semiconductor; FET Type: MOSFET N-Channel, Metal Oxide; FET Feature: Standard; Current - Continuous Drain (Id) @ 25°C: 21A (Ta), 34A (Tc); Rds On (Max) @ Id, Vgs: 4 mOhm @ 20A, 10V; Vgs(th) (Max) @ Id: 2.2V @ 250µA; Gate Charge (Qg) @ Vgs: 45nC @ 10V; Input Capacitance (Ciss) @ Vds: 1540pF @ 15V; Power - Max: 3.1W; Supplier 1: Digi-Key; Manufacturer Part Number: AON7522E; Stock 1: 20465; Pricing 1: 1=0.56, 10=0.471, 25=0.4124, 100=0.3535, 250=0.3064, 500=0.2592, 1000=0.2003, 2500=0.1826 (USD); Category: Discrete Semiconductor Products; Family: Transistors - FETs, MOSFETs - Single; Series: -; Packaging: Tape & Reel (TR); Drain to Source Voltage (Vdss): 30V; Operating Temperature: -55°C ~ 150°C (TJ); Mounting Type: Surface Mount; Package / Case: 8-PowerSMD, Flat Leads; Supplier Device Package: 8-DFN (3x3); ComponentLink1URL: https://datasheet.ciiva.com/6385/aon7522e-6385178.pdf; ComponentLink1Description: https://datasheet.ciiva.com/6385/aon7522e-6385178.pdf; ComponentLink2URL: https://datasheet.ciiva.com/6385/aon7522e-6385181.pdf; ComponentLink2Description: https://datasheet.ciiva.com/6385/aon7522e-6385181.pdf; ComponentLink3URL: https://datasheet.ciiva.com/6385/aon7522e-6385182.pdf; ComponentLink3Description: https://datasheet.ciiva.com/6385/aon7522e-6385182.pdf; Supplier Part Number 1: 785-1505-1-ND
R4#1-R4#14 = RC0603FR-073K3L: as R?#1 on sheet [01] Micro; Supplier 1: Digi-Key; Manufacturer Part Number 1: RC0603FR-073K3L; RoHS: RoHS Compliant; Description 1: RES SMD 3.3K OHM 1% 1/10W 0603; Stock 1: 668905; Pricing 1: 1=0.1, 10=0.014, 25=0.01, 100=0.0057, 250=0.00436, 500=0.00348, 1000=0.00257, 2500=0.00223 (USD); Packaging: Cut Tape (CT); Resistance (Ohms): 3.3k; Tolerance: ±1%; Composition: Thick Film; Features: Moisture Resistant; Operating Temperature: -55°C ~ 155°C; Package / Case: 0603 (1608 Metric); Supplier Device Package: 0603; Size / Dimension: 0.063" L x 0.031" W (1.60mm x 0.80mm); Height: 0.022" (0.55mm); Number of Terminations: 2; ComponentLink1URL: http://www.yageo.com/documents/recent/PYu-RC_Group_51_RoHS_L_04.pdf; ComponentLink1Description: http://www.yageo.com/documents/recent/PYu-RC_Group_51_RoHS_L_04.pdf; Supplier Part Number 1: 311-3.30KHRCT-ND

## Nets that join several sheets
+5V: [01] Micro (J?#2.1 R?#1.2 R?#2.2 R?#3.2), [02] Power (C?#6.2 L?.2 R?#5.2)
MOTOR_SHUNT_LS_A: [01] Micro (5 pins), [02] Power (12 pins), [03] Motor Driver (12 pins), [04] Half-Bridges (9 pins)
VBAT_PROT: [02] Power (10 pins), [03] Motor Driver (C?#10.2 C?#11.2 U?#2.29), [04] Half-Bridges (8 pins)
MOTOR_SHUNT_HS_A: [03] Motor Driver (C?#17.2 U?#2.33 U?#2.44), [04] Half-Bridges (Q?#7.1 R4#8.2 R4#13.1)
MOTOR_SHUNT_HS_B: [03] Motor Driver (C?#19.2 U?#2.31 U?#2.39), [04] Half-Bridges (Q?#8.1 R4#10.2 R4#14.1)
NetC?#8_2: [01] Micro (J?#2.9), [02] Power (C?#8.2 R?#12.1)
NetC?#12_2: [03] Motor Driver (C?#12.2 U?#2.46), [04] Half-Bridges (Q?#4.1 Q?#7.8 R4#2.2)
NetC?#13_2: [01] Micro (J?#2.7), [03] Motor Driver (C?#13.2 R?#16.1 U?#2.5)
NetC?#14_2: [03] Motor Driver (C?#14.2 U?#2.41), [04] Half-Bridges (Q?#5.1 Q?#8.8 R4#4.2)
NetC?#16_2: [03] Motor Driver (C?#16.2 U?#2.36), [04] Half-Bridges (Q?#6.1 Q?#9.8 R4#6.2)
NetC?#18_2: [01] Micro (J?#2.8), [03] Motor Driver (C?#18.2 R?#19.1 U?#2.6)
NetJ?#1_6: [01] Micro (J?#1.6), [03] Motor Driver (U?#2.17)
NetJ?#1_7: [01] Micro (J?#1.7), [03] Motor Driver (U?#2.18)
NetJ?#1_8: [01] Micro (J?#1.8), [03] Motor Driver (U?#2.19)
NetJ?#1_9: [01] Micro (J?#1.9), [03] Motor Driver (U?#2.20)
NetJ?#1_10: [01] Micro (J?#1.10), [03] Motor Driver (U?#2.21)
NetJ?#1_11: [01] Micro (J?#1.11), [03] Motor Driver (U?#2.22)
NetJ?#1_12: [01] Micro (J?#1.12), [03] Motor Driver (U?#2.16)
NetJ?#1_13: [01] Micro (J?#1.13), [02] Power (U?#1.55)
NetJ?#1_14: [01] Micro (J?#1.14), [03] Motor Driver (U?#2.12)
NetJ?#2_4: [01] Micro (J?#2.4), [03] Motor Driver (U?#2.24)
NetJ?#2_5: [01] Micro (J?#2.5), [03] Motor Driver (U?#2.25)
NetJ?#2_6: [01] Micro (J?#2.6), [03] Motor Driver (U?#2.26)
NetJ?#2_10: [01] Micro (J?#2.10), [02] Power (R?#4.1 U?#1.4)
NetR4#1_2: [03] Motor Driver (U?#2.47), [04] Half-Bridges (R4#1.2)
NetR4#3_2: [03] Motor Driver (U?#2.42), [04] Half-Bridges (R4#3.2)
NetR4#5_2: [03] Motor Driver (U?#2.37), [04] Half-Bridges (R4#5.2)
NetR4#7_2: [03] Motor Driver (U?#2.45), [04] Half-Bridges (R4#7.2)
NetR4#9_2: [03] Motor Driver (U?#2.40), [04] Half-Bridges (R4#9.2)
NetR4#11_2: [03] Motor Driver (U?#2.35), [04] Half-Bridges (R4#11.2)